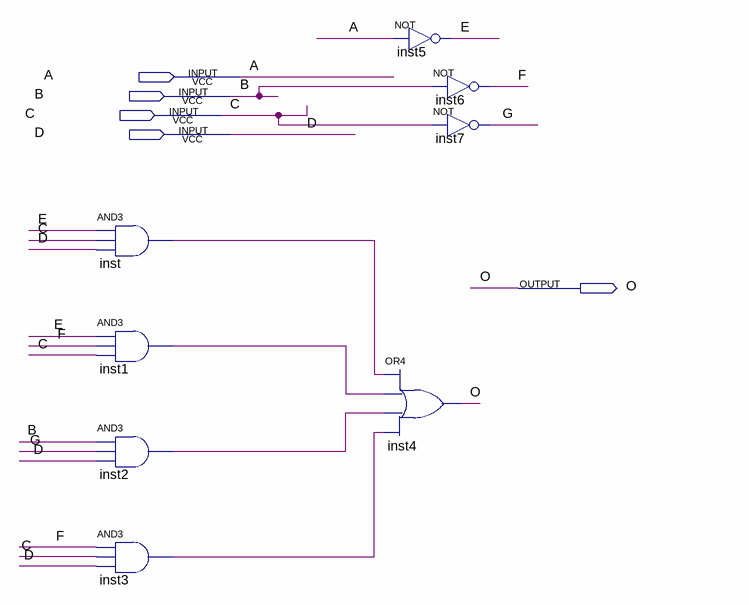
[diagram p0: schematic sheet]
// Quartus schematic prime.bdf as structural Verilog: 8 symbols, 5 pins
module prime (
  input  A,
  input  B,
  input  C,
  input  D,
  output O
);

  wire E, F, G, inst1_out, inst2_out, inst3_out, inst_out;

  and inst (inst_out, E, C, D);
  and inst1 (inst1_out, E, F, C);
  and inst2 (inst2_out, B, G, D);
  and inst3 (inst3_out, F, C, D);
  or inst4 (O, inst_out, inst1_out, inst2_out, inst3_out);
  not inst5 (E, A);
  not inst6 (F, B);
  not inst7 (G, C);
endmodule
